# Altium schematic sheet Titanium_v0.2.SchDoc
size 482 x 292 mm
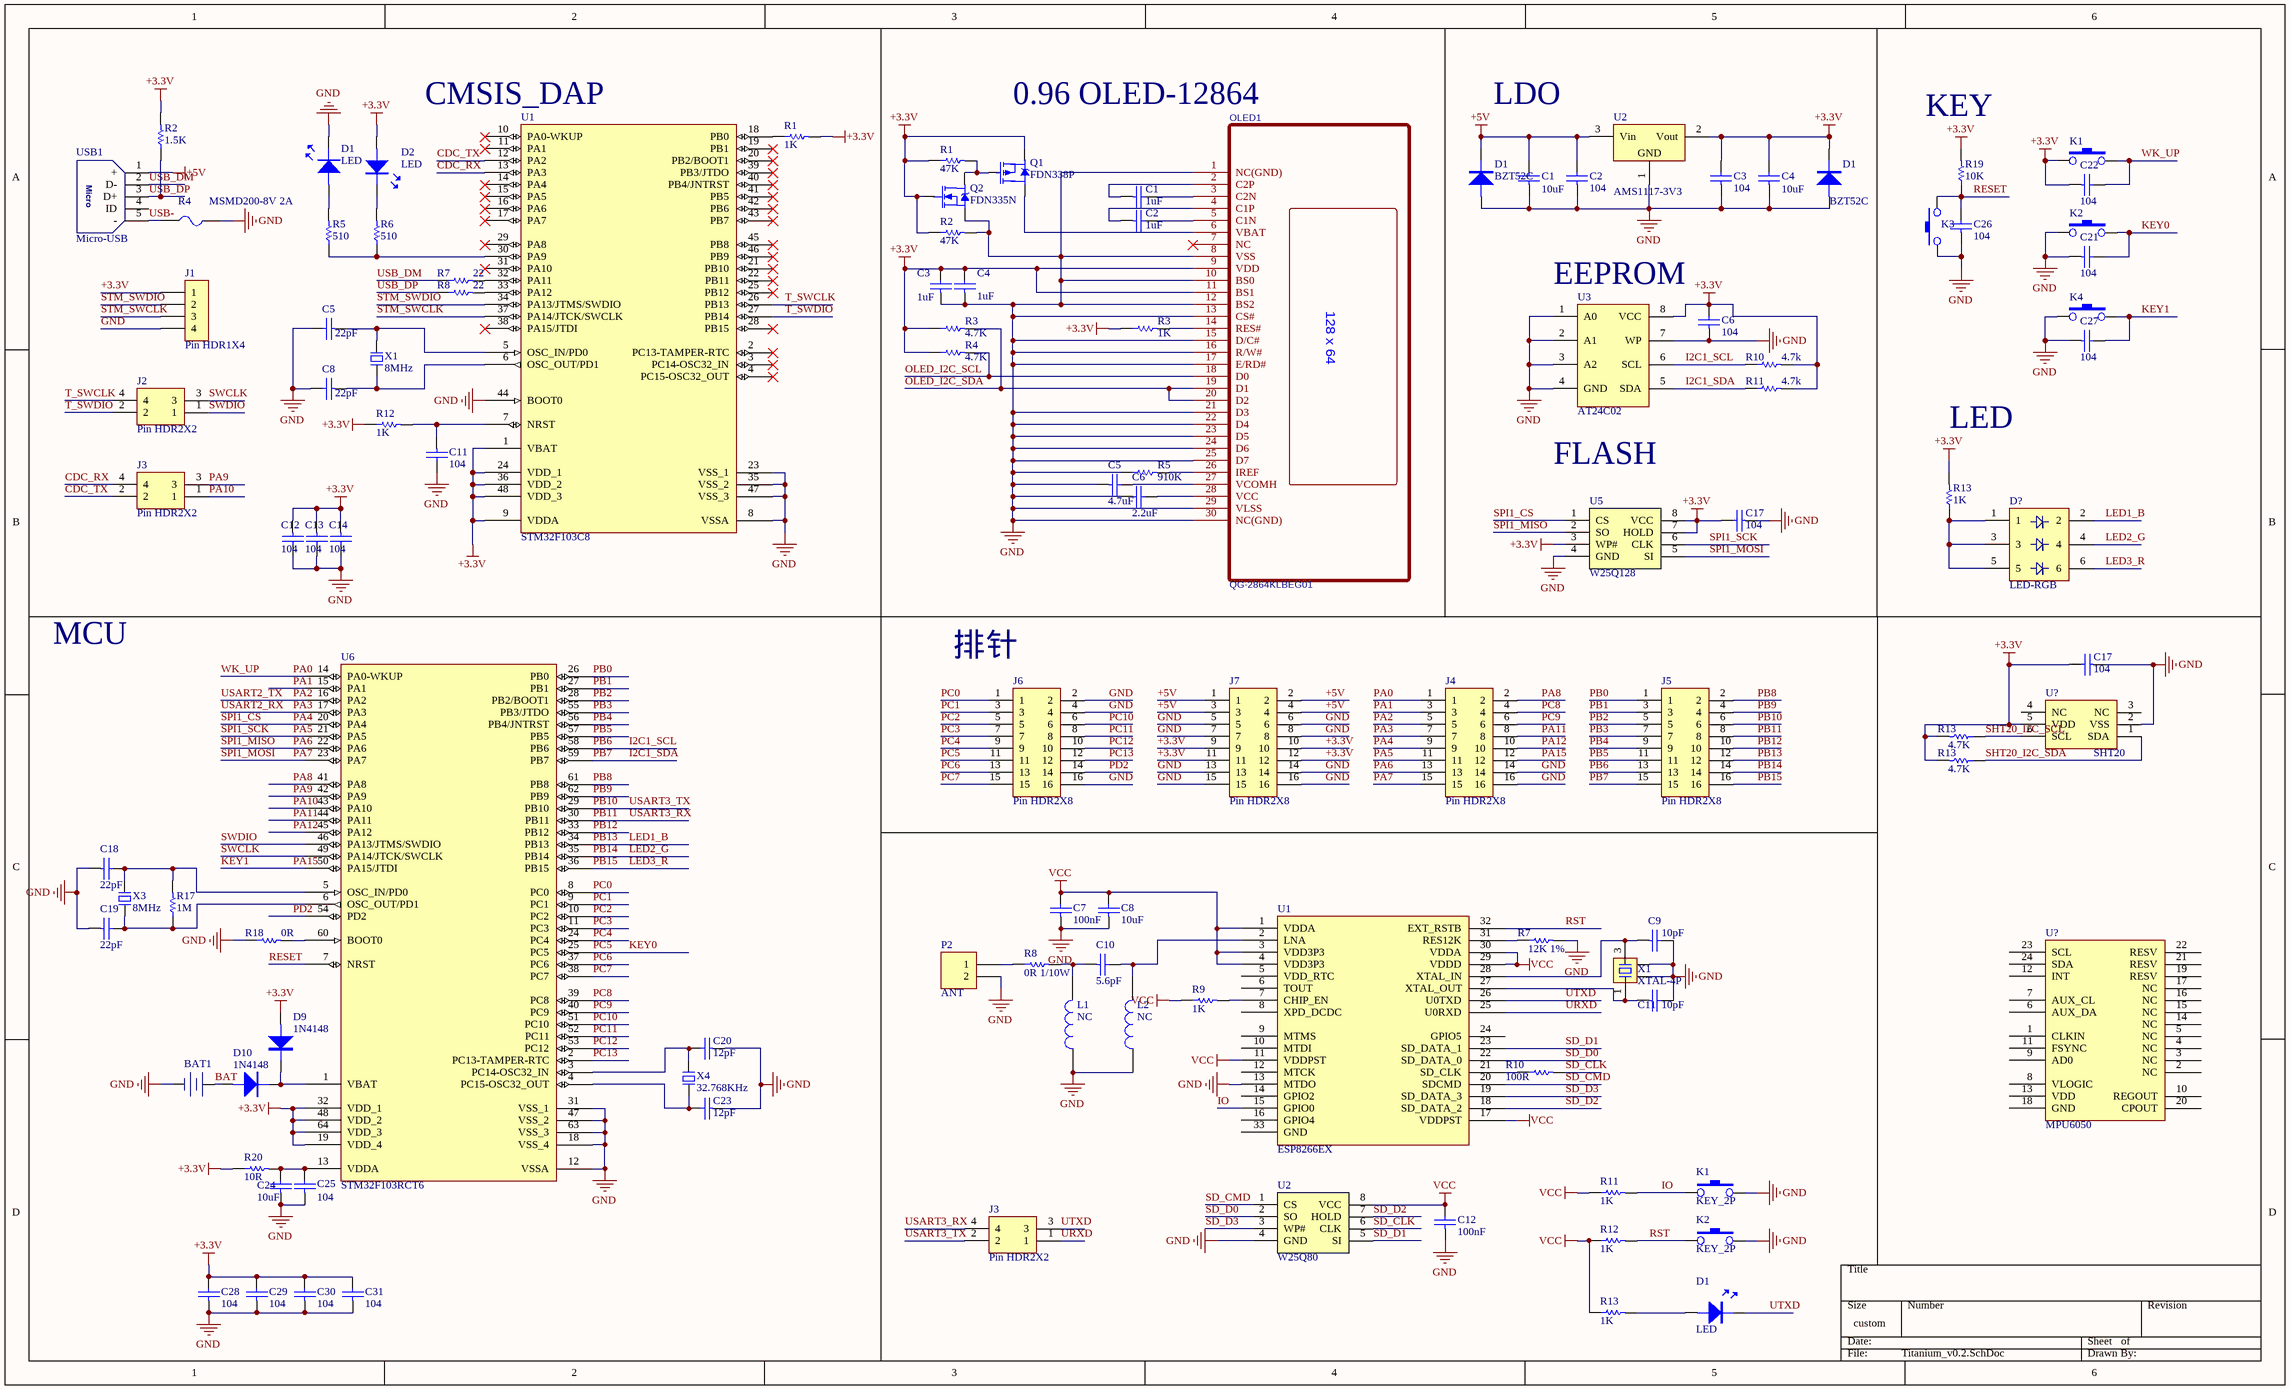
[diagram p0: Titanium_v0.2.SchDoc]

## Parts
(Parts that share a designator on the sheet are numbered #1, #2 ... from top to bottom, then left to right.)
BAT1  CR1220  [CR1220-A]  (value not drawn)
C1#1  1uF  [0603C]
C1#2  10uF  [0603C]
C2#1  104  [0603C]
C2#2  1uF  [0603C]
C3#1  104  [0603C]
C3#2  1uF  [0603C]
C4#1  10uF  [0603C]
C4#2  1uF  [0603C]
C5#1  22pF  [0603C]
C5#2  4.7uF  [0603C]
C6#1  104  [0603C]
C6#2  2.2uF  [0603C]
C7  100nF  [0603C]
C8#1  22pF  [0603C]
C8#2  10uF  [0603C]
C9  10pF  [0603C]
C10  5.6pF  [0603C]
C11#1  104  [0603C]
C11#2  10pF  [0603C]
C12#1  104  [0603C]
C12#2  100nF  [0603C]
C13  104  [0603C]
C14  104  [0603C]
C17#1  104  [0603C]
C17#2  104  [0603C]
C18  22pF  [0603C]
C19  22pF  [0603C]
C20  12pF  [0603C]
C21  104  [0603C]
C22  104  [0603C]
C23  12pF  [0603C]
C24  10uF  [0603C]
C25  104  [0603C]
C26  104  [0603C]
C27  104  [0603C]
C28  104  [0603C]
C29  104  [0603C]
C30  104  [0603C]
C31  104  [0603C]
D1#1  LED  [LED-0603B]
D1#2  BZT52C  [SOD-123]
D1#3  BZT52C  [SOD-123]
D1#4  LED  [LED-0603B]
D2  LED  [LED-0603B]
D9  1N4148  [LL34]
D10  1N4148  [LL34]
D?  LED-RGB  [LED-5050W]
J1  Pin HDR1X4  [Pin HDR1X4/2.54mm-S]
J2  Pin HDR2X2  [Pin HDR2X2/2.54mm-S]
J3#1  Pin HDR2X2  [Pin HDR2X2/2.54mm-S]
J3#2  Pin HDR2X2  [Pin HDR2X2/2.54mm-S]
J4  Pin HDR2X8  [Pin HDR2X8/2.54mm-S]
J5  Pin HDR2X8  [Pin HDR2X8/2.54mm-S]
J6  Pin HDR2X8  [Pin HDR2X8/2.54mm-S]
J7  Pin HDR2X8  [Pin HDR2X8/2.54mm-S]
K1#1  KEY  [DIP-6X6X5]  (value not drawn)
K1#2  KEY_2P  [SW-SMD_KAN0444-0201B/102]
K2#1  KEY  [DIP-6X6X5]  (value not drawn)
K2#2  KEY_2P  [SW-SMD_KAN0444-0201B/102]
K3  KEY  [DIP-6X6X5]  (value not drawn)
K4  KEY  [DIP-6X6X5]  (value not drawn)
L1  NC  [0603C]
L2  NC  [0603C]
OLED1  QG-2864KLBEG01  [OLED-SMD_QG-2864XXX]
P2  ANT  [BLE-ANT4]
Q1  FDN338P  [SOT23]
Q2  FDN335N  [SOT23]
R1#1  1K  [0603R]
R1#2  47K  [0603R]
R2#1  1.5K  [0603R]
R2#2  47K  [0603R]
R3#1  4.7K  [0603R]
R3#2  1K  [0603R]
R4#1  MSMD200-8V 2A  [0805R]
R4#2  4.7K  [0603R]
R5#1  510  [0603R]
R5#2  910K  [0603R]
R6  510  [0603R]
R7#1  22  [0603R]
R7#2  12K 1%  [0603R]
R8#1  22  [0603R]
R8#2  0R 1/10W  [0603R]
R9  1K  [0603R]
R10#1  4.7k  [0603R]
R10#2  100R  [0603R]
R11#1  4.7k  [0603R]
R11#2  1K  [0603R]
R12#1  1K  [0603R]
R12#2  1K  [0603R]
R13#1  1K  [0603R]
R13#2  4.7K  [0603R]
R13#3  4.7K  [0603R]
R13#4  1K  [0603R]
R17  1M  [0603R]
R18  0R  [0603R]
R19  10K  [0603R]
R20  10R  [0603R]
U1#1  STM32F103C8  [LQFP48 7X7]
U1#2  ESP8266EX  [QFN32 5x5]
U2#1  AMS1117-3V3  [SOT89]
U2#2  W25Q80  [SOIC8]
U3  AT24C02  [SOP8]
U5  W25Q128  [SOIC8]
U6  STM32F103RCT6  [LQFP64 10x10]
U?#1  SHT20  [DFN6_3X3]
U?#2  MPU6050  [QFN24_4X4]
USB1  Micro-USB  [USB-MICRO_A]
X1#1  8MHz  [OSC 5032-2P]
X1#2  XTAL-4P  [OSC 3225-4P]
X3  8MHz  [OSC 5032-2P]
X4  32.768KHz  [OSC 3215-2P]

## Nets
+3.3V: C3#1.2 C3#2.2 C4#1.2 C4#2.2 C6#1.2 C12#1.1 C13.1 C14.1 C17#1.2 C17#2.2 C22.1 C28.2 C29.2 C30.2 C31.2 D1#3.K D2.A D9.A J1.1 J7.9 J7.10 J7.11 J7.12 K1#1.1 OLED1.9(VDD) OLED1.11(BS1) Q1.S Q2.G R1#1.2 R1#2.1 R2#1.2 R2#2.1 R3#1.1 R3#2.1 R4#2.1 R10#1.2 R11#1.2 R12#1.1 R13#1.2 R13#2.2 R13#3.2 R19.2 R20.1 U1#1.1(VBAT) U1#1.9(VDDA) U1#1.24(VDD_1) U1#1.36(VDD_2) U1#1.48(VDD_3) U2#1.2(Vout) U3.8(VCC) U5.3(WP#) U5.7(HOLD) U5.8(VCC) U6.19(VDD_4) U6.32(VDD_1) U6.48(VDD_2) U6.64(VDD_3) U?#1.5(VDD)
+5V: C1#2.2 C2#1.2 D1#2.K J7.1 J7.2 J7.3 J7.4 U2#1.3(Vin) USB1.1(+)
GND: BAT1.2 C1#2.1 C2#1.1 C3#1.1 C3#2.1 C4#1.1 C4#2.1 C5#1.2 C5#2.1 C6#1.1 C6#2.1 C7.1 C8#1.2 C8#2.1 C9.2 C11#1.2 C11#2.2 C12#1.2 C12#2.1 C13.2 C14.2 C17#1.1 C17#2.1 C18.1 C19.1 C20.1 C21.1 C23.1 C24.1 C25.1 C26.1 C27.1 C28.1 C29.1 C30.1 C31.1 D1#1.K D1#2.A D1#3.A J1.4 J4.14 J4.16 J6.2 J6.4 J6.16 J7.5 J7.6 J7.7 J7.8 J7.13 J7.14 J7.15 J7.16 K1#2.2 K2#1.1 K2#2.2 K3.1 K4.1 L1.1 L2.1 OLED1.1(NC(GND)) OLED1.8(VSS) OLED1.10(BS0) OLED1.12(BS2) OLED1.13(CS#) OLED1.15(D/C#) OLED1.16(R/W#) OLED1.17(E/RD#) OLED1.21(D3) OLED1.22(D4) OLED1.23(D5) OLED1.24(D6) OLED1.25(D7) OLED1.29(VLSS) OLED1.30(NC(GND)) P2.2 Q2.S R2#2.2 R4#1.2 R5#2.1 R7#2.2 R18.1 U1#1.8(VSSA) U1#1.23(VSS_1) U1#1.35(VSS_2) U1#1.44(BOOT0) U1#1.47(VSS_3) U1#2.13(MTDO) U2#1.1(GND) U2#2.4(GND) U3.1(A0) U3.2(A1) U3.3(A2) U3.4(GND) U3.7(WP) U5.4(GND) U6.12(VSSA) U6.18(VSS_4) U6.31(VSS_1) U6.47(VSS_2) U6.63(VSS_3) U?#1.2(VSS) X1#2.2 X1#2.4
VCC: C7.2 C8#2.2 C12#2.2 R9.1 R11#2.1 R12#2.1 R13#4.1 U1#2.1(VDDA) U1#2.3(VDD3P3) U1#2.4(VDD3P3) U1#2.11(VDDPST) U1#2.17(VDDPST) U1#2.29(VDDD) U1#2.30(VDDA) U2#2.8(VCC)
BAT: BAT1.1 D10.A
CDC_RX: J3#1.4 U1#1.13(PA3)
CDC_TX: J3#1.2 U1#1.12(PA2)
I2C1_SCL: J5.13 R10#1.1 U3.6(SCL) U6.58(PB6)  [also labelled PB6]
I2C1_SDA: J5.15 R11#1.1 U3.5(SDA) U6.59(PB7)  [also labelled PB7]
IO: K1#2.1 R11#2.2 U1#2.15(GPIO0)
KEY0: C21.2 J6.11 K2#1.3 U6.25(PC5)  [also labelled PC5]
KEY1: C27.2 J4.12 K4.3 U6.50(PA15/JTDI)  [also labelled PA15]
LED1_B: D?.2 J5.12 U6.34(PB13)  [also labelled PB13]
LED2_G: D?.4 J5.14 U6.35(PB14)  [also labelled PB14]
LED3_R: D?.6 J5.16 U6.36(PB15)  [also labelled PB15]
OLED_I2C_SCL: OLED1.18(D0) R4#2.2
OLED_I2C_SDA: OLED1.19(D1) OLED1.20(D2) R3#1.2
PA0: C22.2 J4.1 K1#1.3 U6.14(PA0-WKUP)  [also labelled WK_UP]
PA1: J4.3 U6.15(PA1)
PA2: J4.5 U6.16(PA2)  [also labelled USART2_TX]
PA3: J4.7 U6.17(PA3)  [also labelled USART2_RX]
PA4: J4.9 U5.1(CS) U6.20(PA4)  [also labelled SPI1_CS]
PA5: J4.11 U5.6(CLK) U6.21(PA5)  [also labelled SPI1_SCK]
PA6: J4.13 U5.2(SO) U6.22(PA6)  [also labelled SPI1_MISO]
PA7: J4.15 U5.5(SI) U6.23(PA7)  [also labelled SPI1_MOSI]
PA8: J4.2 U6.41(PA8)
PA9: J3#1.3 U6.42(PA9)
PA10: J3#1.1 U6.43(PA10)
PA11: J4.8 U6.44(PA11)
PA12: J4.10 U6.45(PA12)
PB0: J5.1 U6.26(PB0)
PB1: J5.3 U6.27(PB1)
PB2: J5.5 U6.28(PB2/BOOT1)
PB3: J5.7 U6.55(PB3/JTDO)
PB4: J5.9 U6.56(PB4/JNTRST)
PB5: J5.11 U6.57(PB5)
PB8: J5.2 U6.61(PB8)
PB9: J5.4 U6.62(PB9)
PB10: J3#2.2 J5.6 U6.29(PB10)  [also labelled USART3_TX]
PB11: J3#2.4 J5.8 U6.30(PB11)  [also labelled USART3_RX]
PB12: J5.10 U6.33(PB12)
PC0: J6.1 U6.8(PC0)
PC1: J6.3 U6.9(PC1)
PC2: J6.5 U6.10(PC2)
PC3: J6.7 U6.11(PC3)
PC4: J6.9 U6.24(PC4)
PC6: J6.13 U6.37(PC6)
PC7: J6.15 U6.38(PC7)
PC8: J4.4 U6.39(PC8)
PC9: J4.6 U6.40(PC9)
PC10: J6.6 U6.51(PC10)
PC11: J6.8 U6.52(PC11)
PC12: J6.10 U6.53(PC12)
PC13: J6.12 U6.2(PC13-TAMPER-RTC)
PD2: J6.14 U6.54(PD2)
RESET: C26.2 K3.3 R19.1 U6.7(NRST)
RST: K2#2.1 R12#2.2 U1#2.32(EXT_RSTB)
SD_CLK: R10#2.2 U2#2.6(CLK)
SD_CMD: U1#2.20(SDCMD) U2#2.1(CS)
SD_D0: U1#2.22(SD_DATA_0) U2#2.2(SO)
SD_D1: U1#2.23(SD_DATA_1) U2#2.5(SI)
SD_D2: U1#2.18(SD_DATA_2) U2#2.7(HOLD)
SD_D3: U1#2.19(SD_DATA_3) U2#2.3(WP#)
SHT20_I2C_SCL: R13#2.1 U?#1.6(SCL)
SHT20_I2C_SDA: R13#3.1 U?#1.1(SDA)
STM_SWCLK: J1.3 U1#1.37(PA14/JTCK/SWCLK)
STM_SWDIO: J1.2 U1#1.34(PA13/JTMS/SWDIO)
SWCLK: J2.3 U6.49(PA14/JTCK/SWCLK)
SWDIO: J2.1 U6.46(PA13/JTMS/SWDIO)
T_SWCLK: J2.4 U1#1.26(PB13)
T_SWDIO: J2.2 U1#1.27(PB14)
URXD: J3#2.1 U1#2.25(U0RXD)
USB-: R4#1.1 USB1.5(-)
USB_DM: R7#1.1 USB1.2(D-)
USB_DP: R2#1.1 R8#1.1 USB1.3(D+)
UTXD: D1#4.K J3#2.3 U1#2.26(U0TXD)
NetC1#1_1: C1#1.1 OLED1.2(C2P)
NetC1#1_2: C1#1.2 OLED1.3(C2N)
NetC2#2_1: C2#2.1 OLED1.4(C1P)
NetC2#2_2: C2#2.2 OLED1.5(C1N)
NetC5#1_1: C5#1.1 U1#1.5(OSC_IN/PD0) X1#1.2
NetC5#2_2: C5#2.2 OLED1.27(VCOMH)
NetC6#2_2: C6#2.2 OLED1.28(VCC)
NetC8#1_1: C8#1.1 U1#1.6(OSC_OUT/PD1) X1#1.1
NetC9_1: C9.1 U1#2.28(XTAL_IN) X1#2.3
NetC10_1: C10.1 L1.2 R8#2.2
NetC10_2: C10.2 L2.2 U1#2.2(LNA)
NetC11#1_1: C11#1.1 R12#1.2 U1#1.7(NRST)
NetC11#2_1: C11#2.1 U1#2.27(XTAL_OUT) X1#2.1
NetC18_2: C18.2 R17.2 U6.5(OSC_IN/PD0) X3.2
NetC19_2: C19.2 R17.1 U6.6(OSC_OUT/PD1) X3.1
NetC20_2: C20.2 U6.3(PC14-OSC32_IN) X4.1
NetC23_2: C23.2 U6.4(PC15-OSC32_OUT) X4.2
NetC24_2: C24.2 C25.2 R20.2 U6.13(VDDA)
NetD1#1_A: D1#1.A R5#1.2
NetD1#4_A: D1#4.A R13#4.2
NetD2_K: D2.K R6.2
NetD9_K: D9.K D10.K U6.1(VBAT)
NetD?_1: D?.1 D?.3 D?.5 R13#1.1
NetOLED1_6: OLED1.6(VBAT) Q1.D
NetOLED1_14: OLED1.14(RES#) R3#2.2
NetOLED1_26: OLED1.26(IREF) R5#2.2
NetP2_1: P2.1 R8#2.1
NetQ1_G: Q1.G Q2.D R1#2.2
NetR1#1_1: R1#1.1 U1#1.18(PB0)
NetR5#1_1: R5#1.1 R6.1 U1#1.30(PA9)
NetR7#1_2: R7#1.2 U1#1.32(PA11)
NetR7#2_1: R7#2.1 U1#2.31(RES12K)
NetR8#1_2: R8#1.2 U1#1.33(PA12)
NetR9_2: R9.2 U1#2.7(CHIP_EN)
NetR10#2_1: R10#2.1 U1#2.21(SD_CLK)
NetR18_2: R18.2 U6.60(BOOT0)

Not connected (* = marked no-connect by the designer): OLED1 7(NC)*; U1#1 2(PC13-TAMPER-RTC)* 3(PC14-OSC32_IN)* 4(PC15-OSC32_OUT)* 10(PA0-WKUP)* 11(PA1)* 14(PA4)* 15(PA5)* 16(PA6)* 17(PA7)* 19(PB1)* 20(PB2/BOOT1)* 21(PB10)* 22(PB11)* 25(PB12)* 28(PB15)* 29(PA8)* 31(PA10)* 38(PA15/JTDI)* 39(PB3/JTDO)* 40(PB4/JNTRST)* 41(PB5)* 42(PB6)* 43(PB7)* 45(PB8)* 46(PB9)*; U1#2 5(VDD_RTC) 6(TOUT) 8(XPD_DCDC) 9(MTMS) 10(MTDI) 12(MTCK) 14(GPIO2) 16(GPIO4) 24(GPIO5) 33(GND); U?#1 3(NC) 4(NC); U?#2 1(CLKIN) 2(NC) 3(NC) 4(NC) 5(NC) 6(AUX_DA) 7(AUX_CL) 8(VLOGIC) 9(AD0) 10(REGOUT) 11(FSYNC) 12(INT) 13(VDD) 14(NC) 15(NC) 16(NC) 17(NC) 18(GND) 19(RESV) 20(CPOUT) 21(RESV) 22(RESV) 23(SCL) 24(SDA); USB1 4(ID)

## Notes on the sheet
- (near U1#1) CMSIS_DAP
- 0.96 OLED-12864
- LDO
- (near R19) KEY
- (near U3) EEPROM
- LED
- FLASH
- MCU
- (near J6) 排针
- (in symbol Micro-USB) Micro
- (in symbol QG-2864KLBEG01) 128 x 64

## Library data of the parts
C1#1 C1#2 C2#1 C2#2 C3#1 C3#2 C4#1 C4#2 C5#1 C5#2 C6#1 C6#2 C7 C8#1 C8#2 C9 C10 C11#1 C11#2 C12#1 C12#2 C13 C14 C17#1 C17#2 C18-C31 = CAP: 无极性电容
D1#2 D1#3 D9 D10 = DIODE: 普通二极管
D? = LED-5050
L1 L2 = INDUCTOR
OLED1 = QG-2864KLBEG01: BOM_Manufacturer: Allvision; BOM_Supplier: LCSC; BOM_Manufacturer Part: QG-2864KLBEG01; BOM_Supplier Part: C91755; spicePre: O; spiceSymbolName: QG-2864KLBEG01
P2 = Header 2: Header, 2-Pin; LatestRevisionDate: 17-Jul-2002; LatestRevisionNote: Re-released for DXP Platform.; Publisher: Altium Limited
Q1 = P-MOS: P沟道场效应管
Q2 = N-MOS: N沟道场效应管
R1#1 R1#2 R2#1 R2#2 R3#1 R3#2 R4#2 R5#1 R5#2 R6 R7#1 R7#2 R8#1 R8#2 R9 R10#1 R10#2 R11#1 R11#2 R12#1 R12#2 R13#1-R13#4 R17-R20 = RES
R4#1 = FU: 贴片保险丝; 版权归属: 源创客; BOM名称: 贴片保险丝; 学习资源: www.ooocke.com
U1#1 = STM32F103C8: Flaah:64/RAM:20/IO:36; BOM名称: 32位STM单片机; 版权归属: 源创客; 学习资源: www.ooocke.com
U2#1 = AMS1117: 三端稳压芯片; BOM名称: 稳压芯片; 版权归属: 源创客; 学习资源: www.ooocke.com
U2#2 = W25Q128
X1#1 X3 X4 = XTAL-2P: 2脚无源脚晶振; 版权归属: 源创客; BOM名称: 2脚无源脚晶振; 学习资源: www.ooocke.com
X1#2 = XTAL-4P: 4脚无源晶振